# Altium project StLink_Project.PrjPcb (part 2 of 2)
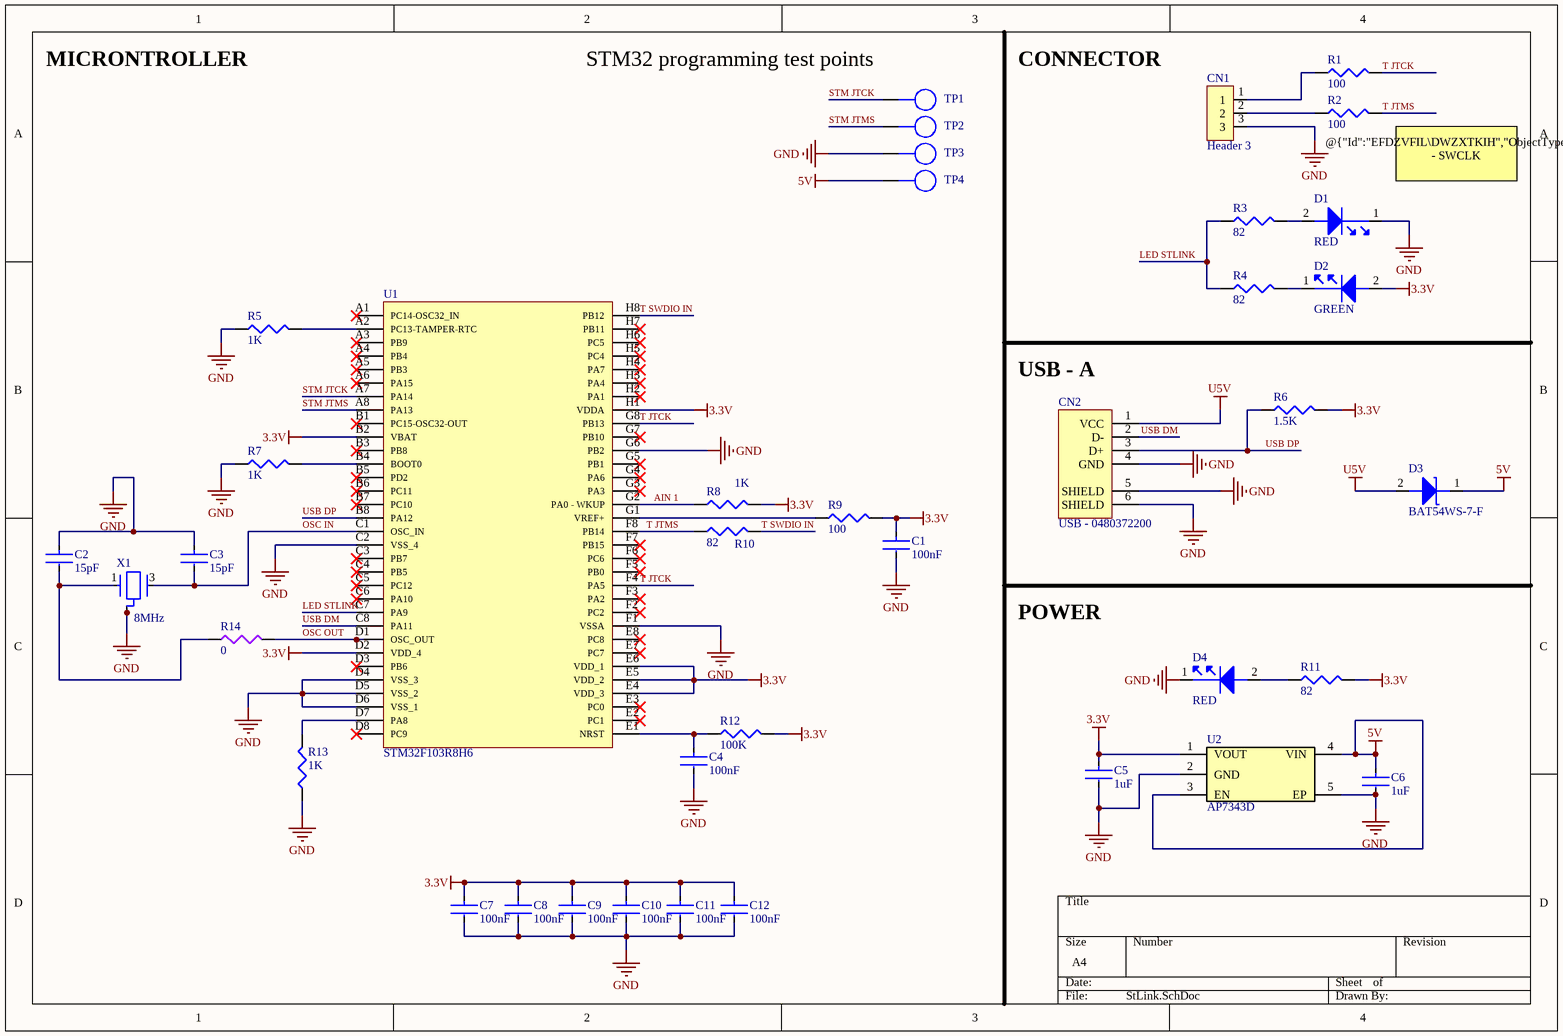
[diagram p1: StLink.SchDoc]

## Sheet StLink.SchDoc (continued)

### Library data of the parts (continued)
R5 R7 R8 R13 = RC0201FR-071KL: Res Thick Film 0201 1K Ohm 1% 0.05W(1/20W) ±200ppm/C Pad SMD T/R; Manufacturer: Yageo Group; Max Power Dissipation: 50mW; Value: 1kΩ; Temperature Coefficient: 200ppm/°C; Voltage Rating: 25V; Supplier: DigiKey; Supplier Part Number: 311-1KMCT-ND; Manufacturer Part Number: RC0201FR-071KL; RoHS: Compliant; Category: Chip SMD Resistors; Stock: 505262; Pricing: 1=0,1, 10=0,034, 25=0,0252, 50=0,0204, 100=0,0168, 250=0,01316, 500=0,01112, 1000=0,00952, 5000=0,00698 (USD); Case/Package: 0201; Case Code (Imperial): 0201; Case Code (Metric): 0603; China RoHS: Non-Compliant; Composition: Thick Film; Contact Plating: Tin; Country of Origin: Mainland China, Taiwan; Depth: 300µm; Export Control Classification Number (ECCN) Code: EAR99; Features: Moisture Resistant; Height: 230µm; Harmonized Tariff Schedule (HTS) Code: 8533.21.00.30; Introduction Date: 2008-07-18; Lead Free: Lead Free; Length: 600µm; Lifecycle Status: Production; Max Operating Temperature: 125°C; Military Standard: Not; Min Operating Temperature: -55°C; Mounting Technology: Surface Mount; Number of Terminals: 2; Number of Terminations: 2; Packaging: Tape & Reel; Power Rating: 50mW; Radiation Hardening: No; REACH SVHC: Yes; Schedule B: 8533210045, 8533210045|8533210045|8533210045|8533210045|8533210045|8533210045|8533210045|8533210045|8533210045|8533210045|8533210045|8533210045|8533210045|8533210045|8533210045|8533210045|8533210045|8533210045|8533210045|8533210045|8533210045|8533210045|8533210045|85; Termination: SMD/SMT; Tolerance: 1%; Voltage Rating (DC): 25V; Width: 300µm; Working Voltage: 25V; ComponentLink1URL: https://datasheet.octopart.com:443/RC0201FR-071KL-Yageo-datasheet-175887523.pdf?src-supplier=Newark; ComponentLink1Description: https://datasheet.octopart.com:443/RC0201FR-071KL-Yageo-datasheet-175887523.pdf?src-supplier=Newark; ComponentLink2URL: https://datasheet.octopart.com:443/RC0201FR-071KL-Yageo-datasheet-10025917.pdf?src-supplier=Newark; ComponentLink2Description: https://datasheet.octopart.com:443/RC0201FR-071KL-Yageo-datasheet-10025917.pdf?src-supplier=Newark; ComponentLink3URL: https://datasheet.octopart.com:443/RC0201FR-071KL-Yageo-datasheet-12509713.pdf?src-supplier=_legacy+Avnet; ComponentLink3Description: https://datasheet.octopart.com:443/RC0201FR-071KL-Yageo-datasheet-12509713.pdf?src-supplier=_legacy+Avnet; ComponentLink4URL: https://datasheet.octopart.com:443/RC0201FR-071KL-Yageo-datasheet-13314888.pdf?src-supplier=Upverter; ComponentLink4Description: https://datasheet.octopart.com:443/RC0201FR-071KL-Yageo-datasheet-13314888.pdf?src-supplier=Upverter; ComponentLink5URL: https://datasheet.octopart.com:443/RC0201FR-071KL-Yageo-datasheet-12549147.pdf?src-supplier=Upverter; ComponentLink5Description: https://datasheet.octopart.com:443/RC0201FR-071KL-Yageo-datasheet-12549147.pdf?src-supplier=Upverter; ComponentLink6URL: https://datasheet.octopart.com:443/RC0201FR-071KL-Yageo-datasheet-12509741.pdf?src-supplier=Upverter; ComponentLink6Description: https://datasheet.octopart.com:443/RC0201FR-071KL-Yageo-datasheet-12509741.pdf?src-supplier=Upverter; ComponentLink7URL: https://datasheet.octopart.com:443/RC0201FR-071KL-Yageo-datasheet-62067350.pdf?src-supplier=element14+APAC; ComponentLink7Description: https://datasheet.octopart.com:443/RC0201FR-071KL-Yageo-datasheet-62067350.pdf?src-supplier=element14+APAC; ComponentLink8URL: https://datasheet.octopart.com:443/RC0201FR-071KL-Yageo-datasheet-10911895.pdf?src-supplier=element14+APAC; ComponentLink8Description: https://datasheet.octopart.com:443/RC0201FR-071KL-Yageo-datasheet-10911895.pdf?src-supplier=element14+APAC; ComponentLink9URL: https://datasheet.octopart.com:443/RC0201FR-071KL-Yageo-Group-datasheet-176638170.pdf?src-supplier=Future+Electronics; ComponentLink9Description: https://datasheet.octopart.com:443/RC0201FR-071KL-Yageo-Group-datasheet-176638170.pdf?src-supplier=Future+Electronics; ComponentLink10URL: https://datasheet.octopart.com:443/RC0201FR-071KL-Yageo-datasheet-164759695.pdf?src-supplier=Future+Electronics; ComponentLink10Description: https://datasheet.octopart.com:443/RC0201FR-071KL-Yageo-datasheet-164759695.pdf?src-supplier=Future+Electronics; ComponentLink11URL: https://datasheet.octopart.com:443/RC0201FR-071KL-Yageo-datasheet-127823281.pdf?src-supplier=Future+Electronics; ComponentLink11Description: https://datasheet.octopart.com:443/RC0201FR-071KL-Yageo-datasheet-127823281.pdf?src-supplier=Future+Electronics; ComponentLink12URL: https://datasheet.octopart.com:443/RC0201FR-071KL-Yageo-datasheet-137700087.pdf?src-supplier=Future+Electronics; ComponentLink12Description: https://datasheet.octopart.com:443/RC0201FR-071KL-Yageo-datasheet-137700087.pdf?src-supplier=Future+Electronics; ComponentLink13URL: https://datasheet.octopart.com:443/RC0201FR-071KL-Yageo-datasheet-103092701.pdf?src-supplier=Future+Electronics; ComponentLink13Description: https://datasheet.octopart.com:443/RC0201FR-071KL-Yageo-datasheet-103092701.pdf?src-supplier=Future+Electronics; ComponentLink14URL: https://datasheet.octopart.com:443/RC0201FR-071KL-Yageo-datasheet-98239111.pdf?src-supplier=Future+Electronics; ComponentLink14Description: https://datasheet.octopart.com:443/RC0201FR-071KL-Yageo-datasheet-98239111.pdf?src-supplier=Future+Electronics; ComponentLink15URL: https://datasheet.octopart.com:443/RC0201FR-071KL-Yageo-datasheet-44382975.pdf?src-supplier=Future+Electronics; ComponentLink15Description: https://datasheet.octopart.com:443/RC0201FR-071KL-Yageo-datasheet-44382975.pdf?src-supplier=Future+Electronics; ComponentLink16URL: https://datasheet.octopart.com:443/RC0201FR-071KL-Yageo-datasheet-41589693.pdf?src-supplier=Future+Electronics; ComponentLink16Description: https://datasheet.octopart.com:443/RC0201FR-071KL-Yageo-datasheet-41589693.pdf?src-supplier=Future+Electronics; ComponentLink17URL: https://datasheet.octopart.com:443/RC0201FR-071KL-Yageo-datasheet-37140709.pdf?src-supplier=Future+Electronics; ComponentLink17Description: https://datasheet.octopart.com:443/RC0201FR-071KL-Yageo-datasheet-37140709.pdf?src-supplier=Future+Electronics; ComponentLink18URL: https://datasheet.octopart.com:443/RC0201FR-071KL-Yageo-datasheet-12509768.pdf?src-supplier=Future+Electronics; ComponentLink18Description: https://datasheet.octopart.com:443/RC0201FR-071KL-Yageo-datasheet-12509768.pdf?src-supplier=Future+Electronics; ComponentLink19URL: https://datasheet.octopart.com:443/RC0201FR-071KL-Yageo-datasheet-12590898.pdf?src-supplier=Future+Electronics; ComponentLink19Description: https://datasheet.octopart.com:443/RC0201FR-071KL-Yageo-datasheet-12590898.pdf?src-supplier=Future+Electronics; ComponentLink20URL: https://datasheet.octopart.com:443/RC0201FR-071KL-Yageo-datasheet-12535854.pdf?src-supplier=Future+Electronics; ComponentLink20Description: https://datasheet.octopart.com:443/RC0201FR-071KL-Yageo-datasheet-12535854.pdf?src-supplier=Future+Electronics; ComponentLink21URL: https://datasheet.octopart.com:443/RC0201FR-071KL-Yageo-datasheet-148775077.pdf?src-supplier=TME; ComponentLink21Description: https://datasheet.octopart.com:443/RC0201FR-071KL-Yageo-datasheet-148775077.pdf?src-supplier=TME; ComponentLink22URL: https://datasheet.octopart.com:443/RC0201FR-071KL-Yageo-datasheet-79472498.pdf?src-supplier=Megastar; ComponentLink22Description: https://datasheet.octopart.com:443/RC0201FR-071KL-Yageo-datasheet-79472498.pdf?src-supplier=Megastar; ComponentLink23URL: https://datasheet.octopart.com/RC0201FR-071KL-Yageo-datasheet-73766026.pdf; ComponentLink23Description: https://datasheet.octopart.com/RC0201FR-071KL-Yageo-datasheet-73766026.pdf; ComponentLink24URL: http://sigma.octopart.com:80/conflict_mineral_statement/Yageo-company-3.pdf?src-supplier=Compliance+Statements; ComponentLink24Description: http://sigma.octopart.com:80/conflict_mineral_statement/Yageo-company-3.pdf?src-supplier=Compliance+Statements; ComponentLink25URL: http://sigma.octopart.com:80/rohs_statement/Yageo-company-2.pdf?src-supplier=Compliance+Statements; ComponentLink25Description: http://sigma.octopart.com:80/rohs_statement/Yageo-company-2.pdf?src-supplier=Compliance+Statements; Supplier 1: DigiKey; Supplier Part Number 1: 311-1KMCT-ND
R6 = RC0201JR-071K5L: Res Thick Film 0201 1.5K Ohm 5% 0.05W(1/20W) ±200ppm/C Pad SMD T/R; Manufacturer: Yageo Group; Max Power Dissipation: 50mW; Value: 1.5kΩ; Temperature Coefficient: 200ppm/°C; Voltage Rating: 25V; Supplier: DigiKey; Supplier Part Number: 311-1.5KNCT-ND; Manufacturer Part Number: RC0201JR-071K5L; RoHS: Compliant; Category: Chip SMD Resistors; Stock: 229427; Pricing: 1=0,1, 10=0,028, 25=0,0204, 50=0,0166, 100=0,0135, 250=0,01048, 500=0,00878, 1000=0,00744, 5000=0,00534 (USD); Case/Package: 0201; Case Code (Imperial): 0201; Case Code (Metric): 0603; China RoHS: Non-Compliant; Composition: Thick Film; Contact Plating: Tin; Country of Origin: Mainland China, Taiwan; Depth: 300µm; Export Control Classification Number (ECCN) Code: EAR99; Features: Moisture Resistant; Height: 230µm; Harmonized Tariff Schedule (HTS) Code: 8533.21.00.30; Introduction Date: 2008-07-18; Lead Free: Lead Free; Length: 600µm; Lifecycle Status: Production; Max Operating Temperature: 125°C; Military Standard: Not; Min Operating Temperature: -55°C; Mounting Technology: Surface Mount; Pins: 2; Number of Terminals: 2; Number of Terminations: 2; Packaging: Tape & Reel; Power Rating: 50mW; Radiation Hardening: No; REACH SVHC: Yes; Schedule B: 8533210045, 8533210045|8533210045|8533210045|8533210045|8533210045; Termination: SMD/SMT; Tolerance: 5%; Voltage Rating (DC): 25V; Width: 300µm; Working Voltage: 25V; ComponentLink1URL: https://datasheet.octopart.com:443/RC0201JR-071K5L-Yageo-datasheet-175887523.pdf?src-supplier=IHS; ComponentLink1Description: https://datasheet.octopart.com:443/RC0201JR-071K5L-Yageo-datasheet-175887523.pdf?src-supplier=IHS; ComponentLink2URL: https://datasheet.octopart.com:443/RC0201JR-071K5L-Yageo-Group-datasheet-176638170.pdf?src-supplier=Future+Electronics; ComponentLink2Description: https://datasheet.octopart.com:443/RC0201JR-071K5L-Yageo-Group-datasheet-176638170.pdf?src-supplier=Future+Electronics; ComponentLink3URL: https://datasheet.octopart.com:443/RC0201JR-071K5L-Yageo-datasheet-164759695.pdf?src-supplier=Future+Electronics; ComponentLink3Description: https://datasheet.octopart.com:443/RC0201JR-071K5L-Yageo-datasheet-164759695.pdf?src-supplier=Future+Electronics; ComponentLink4URL: https://datasheet.octopart.com:443/RC0201JR-071K5L-Yageo-datasheet-127823281.pdf?src-supplier=Future+Electronics; ComponentLink4Description: https://datasheet.octopart.com:443/RC0201JR-071K5L-Yageo-datasheet-127823281.pdf?src-supplier=Future+Electronics; ComponentLink5URL: https://datasheet.octopart.com:443/RC0201JR-071K5L-Yageo-datasheet-137700087.pdf?src-supplier=Future+Electronics; ComponentLink5Description: https://datasheet.octopart.com:443/RC0201JR-071K5L-Yageo-datasheet-137700087.pdf?src-supplier=Future+Electronics; ComponentLink6URL: https://datasheet.octopart.com:443/RC0201JR-071K5L-Yageo-datasheet-103092701.pdf?src-supplier=Future+Electronics; ComponentLink6Description: https://datasheet.octopart.com:443/RC0201JR-071K5L-Yageo-datasheet-103092701.pdf?src-supplier=Future+Electronics; ComponentLink7URL: https://datasheet.octopart.com:443/RC0201JR-071K5L-Yageo-datasheet-98239111.pdf?src-supplier=Future+Electronics; ComponentLink7Description: https://datasheet.octopart.com:443/RC0201JR-071K5L-Yageo-datasheet-98239111.pdf?src-supplier=Future+Electronics; ComponentLink8URL: https://datasheet.octopart.com:443/RC0201JR-071K5L-Yageo-datasheet-79472498.pdf?src-supplier=Future+Electronics; ComponentLink8Description: https://datasheet.octopart.com:443/RC0201JR-071K5L-Yageo-datasheet-79472498.pdf?src-supplier=Future+Electronics; ComponentLink9URL: https://datasheet.octopart.com:443/RC0201JR-071K5L-Yageo-datasheet-12535854.pdf?src-supplier=Future+Electronics; ComponentLink9Description: https://datasheet.octopart.com:443/RC0201JR-071K5L-Yageo-datasheet-12535854.pdf?src-supplier=Future+Electronics; ComponentLink10URL: https://datasheet.octopart.com/RC0201JR-071K5L-Yageo-datasheet-73766026.pdf; ComponentLink10Description: https://datasheet.octopart.com/RC0201JR-071K5L-Yageo-datasheet-73766026.pdf; ComponentLink11URL: https://datasheet.octopart.com:443/RC0201JR-071K5L-Yageo-datasheet-10911895.pdf?src-supplier=Farnell; ComponentLink11Description: https://datasheet.octopart.com:443/RC0201JR-071K5L-Yageo-datasheet-10911895.pdf?src-supplier=Farnell; ComponentLink12URL: https://datasheet.octopart.com:443/RC0201JR-071K5L-Yageo-datasheet-8325180.pdf?src-supplier=Farnell; ComponentLink12Description: https://datasheet.octopart.com:443/RC0201JR-071K5L-Yageo-datasheet-8325180.pdf?src-supplier=Farnell; ComponentLink13URL: http://sigma.octopart.com:80/conflict_mineral_statement/Yageo-company-3.pdf?src-supplier=Compliance+Statements; ComponentLink13Description: http://sigma.octopart.com:80/conflict_mineral_statement/Yageo-company-3.pdf?src-supplier=Compliance+Statements; ComponentLink14URL: http://sigma.octopart.com:80/rohs_statement/Yageo-company-2.pdf?src-supplier=Compliance+Statements; ComponentLink14Description: http://sigma.octopart.com:80/rohs_statement/Yageo-company-2.pdf?src-supplier=Compliance+Statements; Supplier 1: DigiKey; Supplier Part Number 1: 311-1.5KNCT-ND
R12 = RC0201FR-07100KL: 50mW Thick Film Resistors 25V ±1% ±200ppm/℃ 100kΩ 0201 Chip Resistor - Surface Mount ROHS; Manufacturer: Yageo Group; Temperature Coefficient: 200ppm/°C; Supplier: DigiKey; Supplier Part Number: 311-100KMDKR-ND; Manufacturer Part Number: RC0201FR-07100KL; RoHS: Compliant; Category: Chip SMD Resistors; Stock: 1290882; Pricing: 1=0,1, 10=0,034, 25=0,0252, 50=0,0204, 100=0,0168, 250=0,01316, 500=0,01112, 1000=0,00952, 5000=0,00698 (USD); Case/Package: 0201; Case Code (Imperial): 0201; Case Code (Metric): 0603; China RoHS: Non-Compliant; Composition: Thick Film; Contact Plating: Tin; Depth: 300µm; Features: Moisture Resistant; Height: 230µm; Lead Free: Lead Free; Length: 600µm; Lifecycle Status: Production; Max Operating Temperature: 125°C; Max Power Dissipation: 50mW; Military Standard: Not; Min Operating Temperature: -55°C; Mounting Technology: Surface Mount; Pins: 2; Number of Terminals: 2; Number of Terminations: 2; Packaging: Tape & Reel; Power Rating: 50mW; REACH SVHC: Yes; Value: 100kΩ; Schedule B: 8533210045, 8533210045|8533210045|8533210045|8533210045|8533210045|8533210045|8533210045|8533210045|8533210045|8533210045|8533210045|8533210045|8533210045|8533210045, 8533210045|8533210045|8533210045|8533210045|8533210045|8533210045|8533210045|8533210045|8533210045|8533210045|8533210045|8533210045|8533210045|8533210045|8533210045, 8533210045|8533210045|8533210045|8533210045|8533210045|8533210045|8533210045|8533210045|8533210045|8533210045|8533210045|8533210045|8533210045|8533210045|8533210045|8533210045; Termination: SMD/SMT; Tolerance: 1%; Voltage Rating: 25V; Voltage Rating (DC): 25V; Width: 300µm; Working Voltage: 25V; ComponentLink1URL: https://datasheet.octopart.com:443/RC0201FR-07100KL-Yageo-datasheet-175887523.pdf?src-supplier=IHS; ComponentLink1Description: https://datasheet.octopart.com:443/RC0201FR-07100KL-Yageo-datasheet-175887523.pdf?src-supplier=IHS; ComponentLink2URL: https://datasheet.octopart.com:443/RC0201FR-07100KL-Yageo-datasheet-12509713.pdf?src-supplier=element14+APAC; ComponentLink2Description: https://datasheet.octopart.com:443/RC0201FR-07100KL-Yageo-datasheet-12509713.pdf?src-supplier=element14+APAC; ComponentLink3URL: https://datasheet.octopart.com:443/RC0201FR-07100KL-Yageo-datasheet-62067350.pdf?src-supplier=element14+APAC; ComponentLink3Description: https://datasheet.octopart.com:443/RC0201FR-07100KL-Yageo-datasheet-62067350.pdf?src-supplier=element14+APAC; ComponentLink4URL: https://datasheet.octopart.com:443/RC0201FR-07100KL-Yageo-datasheet-10911895.pdf?src-supplier=element14+APAC; ComponentLink4Description: https://datasheet.octopart.com:443/RC0201FR-07100KL-Yageo-datasheet-10911895.pdf?src-supplier=element14+APAC; ComponentLink5URL: https://datasheet.octopart.com:443/RC0201FR-07100KL-Yageo-datasheet-13314888.pdf?src-supplier=Upverter; ComponentLink5Description: https://datasheet.octopart.com:443/RC0201FR-07100KL-Yageo-datasheet-13314888.pdf?src-supplier=Upverter; ComponentLink6URL: https://datasheet.octopart.com:443/RC0201FR-07100KL-Yageo-datasheet-12549147.pdf?src-supplier=Upverter; ComponentLink6Description: https://datasheet.octopart.com:443/RC0201FR-07100KL-Yageo-datasheet-12549147.pdf?src-supplier=Upverter; ComponentLink7URL: https://datasheet.octopart.com:443/RC0201FR-07100KL-Yageo-datasheet-12509741.pdf?src-supplier=Upverter; ComponentLink7Description: https://datasheet.octopart.com:443/RC0201FR-07100KL-Yageo-datasheet-12509741.pdf?src-supplier=Upverter; ComponentLink8URL: https://datasheet.octopart.com:443/RC0201FR-07100KL-Yageo-Group-datasheet-190305687.pdf?src-supplier=Newark; ComponentLink8Description: https://datasheet.octopart.com:443/RC0201FR-07100KL-Yageo-Group-datasheet-190305687.pdf?src-supplier=Newark; ComponentLink9URL: https://datasheet.octopart.com:443/RC0201FR-07100KL-Yageo-datasheet-10025917.pdf?src-supplier=Newark; ComponentLink9Description: https://datasheet.octopart.com:443/RC0201FR-07100KL-Yageo-datasheet-10025917.pdf?src-supplier=Newark; ComponentLink10URL: https://datasheet.octopart.com:443/RC0201FR-07100KL-Yageo-Group-datasheet-176638170.pdf?src-supplier=Future+Electronics; ComponentLink10Description: https://datasheet.octopart.com:443/RC0201FR-07100KL-Yageo-Group-datasheet-176638170.pdf?src-supplier=Future+Electronics; ComponentLink11URL: https://datasheet.octopart.com:443/RC0201FR-07100KL-Yageo-datasheet-164759695.pdf?src-supplier=Future+Electronics; ComponentLink11Description: https://datasheet.octopart.com:443/RC0201FR-07100KL-Yageo-datasheet-164759695.pdf?src-supplier=Future+Electronics; ComponentLink12URL: https://datasheet.octopart.com:443/RC0201FR-07100KL-Yageo-datasheet-127823281.pdf?src-supplier=Future+Electronics; ComponentLink12Description: https://datasheet.octopart.com:443/RC0201FR-07100KL-Yageo-datasheet-127823281.pdf?src-supplier=Future+Electronics; ComponentLink13URL: https://datasheet.octopart.com:443/RC0201FR-07100KL-Yageo-datasheet-137700087.pdf?src-supplier=Future+Electronics; ComponentLink13Description: https://datasheet.octopart.com:443/RC0201FR-07100KL-Yageo-datasheet-137700087.pdf?src-supplier=Future+Electronics; ComponentLink14URL: https://datasheet.octopart.com:443/RC0201FR-07100KL-Yageo-datasheet-103092701.pdf?src-supplier=Future+Electronics; ComponentLink14Description: https://datasheet.octopart.com:443/RC0201FR-07100KL-Yageo-datasheet-103092701.pdf?src-supplier=Future+Electronics; ComponentLink15URL: https://datasheet.octopart.com:443/RC0201FR-07100KL-Yageo-datasheet-98239111.pdf?src-supplier=Future+Electronics; ComponentLink15Description: https://datasheet.octopart.com:443/RC0201FR-07100KL-Yageo-datasheet-98239111.pdf?src-supplier=Future+Electronics; ComponentLink16URL: https://datasheet.octopart.com:443/RC0201FR-07100KL-Yageo-datasheet-44382975.pdf?src-supplier=Future+Electronics; ComponentLink16Description: https://datasheet.octopart.com:443/RC0201FR-07100KL-Yageo-datasheet-44382975.pdf?src-supplier=Future+Electronics; ComponentLink17URL: https://datasheet.octopart.com:443/RC0201FR-07100KL-Yageo-datasheet-41589693.pdf?src-supplier=Future+Electronics; ComponentLink17Description: https://datasheet.octopart.com:443/RC0201FR-07100KL-Yageo-datasheet-41589693.pdf?src-supplier=Future+Electronics; ComponentLink18URL: https://datasheet.octopart.com:443/RC0201FR-07100KL-Yageo-datasheet-37140709.pdf?src-supplier=Future+Electronics; ComponentLink18Description: https://datasheet.octopart.com:443/RC0201FR-07100KL-Yageo-datasheet-37140709.pdf?src-supplier=Future+Electronics; ComponentLink19URL: https://datasheet.octopart.com:443/RC0201FR-07100KL-Yageo-datasheet-12590898.pdf?src-supplier=Future+Electronics; ComponentLink19Description: https://datasheet.octopart.com:443/RC0201FR-07100KL-Yageo-datasheet-12590898.pdf?src-supplier=Future+Electronics; ComponentLink20URL: https://datasheet.octopart.com:443/RC0201FR-07100KL-Yageo-datasheet-5319114.pdf?src-supplier=Future+Electronics; ComponentLink20Description: https://datasheet.octopart.com:443/RC0201FR-07100KL-Yageo-datasheet-5319114.pdf?src-supplier=Future+Electronics; ComponentLink21URL: https://datasheet.octopart.com:443/RC0201FR-07100KL-Yageo-datasheet-12535854.pdf?src-supplier=Future+Electronics; ComponentLink21Description: https://datasheet.octopart.com:443/RC0201FR-07100KL-Yageo-datasheet-12535854.pdf?src-supplier=Future+Electronics; ComponentLink22URL: https://datasheet.octopart.com:443/RC0201FR-07100KL-Yageo-datasheet-148775077.pdf?src-supplier=TME; ComponentLink22Description: https://datasheet.octopart.com:443/RC0201FR-07100KL-Yageo-datasheet-148775077.pdf?src-supplier=TME; ComponentLink23URL: https://datasheet.octopart.com/RC0201FR-07100KL-Yageo-datasheet-73766026.pdf; ComponentLink23Description: https://datasheet.octopart.com/RC0201FR-07100KL-Yageo-datasheet-73766026.pdf; ComponentLink24URL: https://datasheet.octopart.com:443/RC0201FR-07100KL-Yageo-datasheet-8701561.pdf?src-supplier=element14; ComponentLink24Description: https://datasheet.octopart.com:443/RC0201FR-07100KL-Yageo-datasheet-8701561.pdf?src-supplier=element14; ComponentLink25URL: http://sigma.octopart.com:80/conflict_mineral_statement/Yageo-company-3.pdf?src-supplier=Compliance+Statements; ComponentLink25Description: http://sigma.octopart.com:80/conflict_mineral_statement/Yageo-company-3.pdf?src-supplier=Compliance+Statements; ComponentLink26URL: http://sigma.octopart.com:80/rohs_statement/Yageo-company-2.pdf?src-supplier=Compliance+Statements; ComponentLink26Description: http://sigma.octopart.com:80/rohs_statement/Yageo-company-2.pdf?src-supplier=Compliance+Statements; Supplier 1: DigiKey; Supplier Part Number 1: 311-100KMDKR-ND
R14 = RC0201JR-070RL: GENERAL PURPOSE CHIP RESISTOR Metal Glaze/thick Film, 0.05W, 0ohm, Surface Mount, 0201; Manufacturer: Yageo Group; Max Power Dissipation: 50mW; Value: 0Ω; Temperature Coefficient: 200ppm/°C; Tolerance: 5%; Voltage Rating: 25V; Supplier: DigiKey; Supplier Part Number: 311-0.0NDKR-ND; Manufacturer Part Number: RC0201JR-070RL; RoHS: Compliant; Category: Chip SMD Resistors; Stock: 2082175; Pricing: 1=0,1, 10=0,019, 25=0,0156, 50=0,0138, 100=0,012, 250=0,01008, 500=0,0089, 1000=0,0079, 5000=0,00609 (USD); Case/Package: 0201; Case Code (Imperial): 0201; Case Code (Metric): 0603; China RoHS: Non-Compliant; Composition: Thick Film; Contact Plating: Tin; Depth: 300µm; Features: Moisture Resistant; Height: 230µm; Lead Free: Lead Free; Length: 600µm; Lifecycle Status: Production; Max Operating Temperature: 125°C; Military Standard: Not; Min Operating Temperature: -55°C; Mounting Technology: Surface Mount; Pins: 2; Number of Terminals: 2; Number of Terminations: 2; Packaging: Tape & Reel; Power Rating: 50mW; Radiation Hardening: No; REACH SVHC: Yes; Termination: SMD/SMT; Voltage Rating (DC): 25V; Weight: 170.097139µg; Width: 300µm; ComponentLink1URL: https://datasheet.octopart.com:443/RC0201JR-070RL-Yageo-datasheet-182189538.pdf?src-supplier=IHS; ComponentLink1Description: https://datasheet.octopart.com:443/RC0201JR-070RL-Yageo-datasheet-182189538.pdf?src-supplier=IHS; ComponentLink2URL: https://datasheet.octopart.com:443/RC0201JR-070RL-Yageo-datasheet-127823281.pdf?src-supplier=Upverter; ComponentLink2Description: https://datasheet.octopart.com:443/RC0201JR-070RL-Yageo-datasheet-127823281.pdf?src-supplier=Upverter; ComponentLink3URL: https://datasheet.octopart.com:443/RC0201JR-070RL-Yageo-Group-datasheet-190305687.pdf?src-supplier=Newark; ComponentLink3Description: https://datasheet.octopart.com:443/RC0201JR-070RL-Yageo-Group-datasheet-190305687.pdf?src-supplier=Newark; ComponentLink4URL: https://datasheet.octopart.com:443/RC0201JR-070RL-Yageo-datasheet-8325180.pdf?src-supplier=Newark; ComponentLink4Description: https://datasheet.octopart.com:443/RC0201JR-070RL-Yageo-datasheet-8325180.pdf?src-supplier=Newark; ComponentLink5URL: https://datasheet.octopart.com:443/RC0201JR-070RL-Yageo-datasheet-12509713.pdf?src-supplier=element14+APAC; ComponentLink5Description: https://datasheet.octopart.com:443/RC0201JR-070RL-Yageo-datasheet-12509713.pdf?src-supplier=element14+APAC; ComponentLink6URL: https://datasheet.octopart.com:443/RC0201JR-070RL-Yageo-datasheet-62067350.pdf?src-supplier=element14+APAC; ComponentLink6Description: https://datasheet.octopart.com:443/RC0201JR-070RL-Yageo-datasheet-62067350.pdf?src-supplier=element14+APAC; ComponentLink7URL: https://datasheet.octopart.com:443/RC0201JR-070RL-Yageo-datasheet-10911895.pdf?src-supplier=element14+APAC; ComponentLink7Description: https://datasheet.octopart.com:443/RC0201JR-070RL-Yageo-datasheet-10911895.pdf?src-supplier=element14+APAC; ComponentLink8URL: https://datasheet.octopart.com:443/RC0201JR-070RL-Yageo-Group-datasheet-176638170.pdf?src-supplier=Future+Electronics; ComponentLink8Description: https://datasheet.octopart.com:443/RC0201JR-070RL-Yageo-Group-datasheet-176638170.pdf?src-supplier=Future+Electronics; ComponentLink9URL: https://datasheet.octopart.com:443/RC0201JR-070RL-Yageo-datasheet-164759695.pdf?src-supplier=Future+Electronics; ComponentLink9Description: https://datasheet.octopart.com:443/RC0201JR-070RL-Yageo-datasheet-164759695.pdf?src-supplier=Future+Electronics; ComponentLink10URL: https://datasheet.octopart.com:443/RC0201JR-070RL-Yageo-datasheet-137700087.pdf?src-supplier=Future+Electronics; ComponentLink10Description: https://datasheet.octopart.com:443/RC0201JR-070RL-Yageo-datasheet-137700087.pdf?src-supplier=Future+Electronics; ComponentLink11URL: https://datasheet.octopart.com:443/RC0201JR-070RL-Yageo-datasheet-103092701.pdf?src-supplier=Future+Electronics; ComponentLink11Description: https://datasheet.octopart.com:443/RC0201JR-070RL-Yageo-datasheet-103092701.pdf?src-supplier=Future+Electronics; ComponentLink12URL: https://datasheet.octopart.com:443/RC0201JR-070RL-Yageo-datasheet-98239111.pdf?src-supplier=Future+Electronics; ComponentLink12Description: https://datasheet.octopart.com:443/RC0201JR-070RL-Yageo-datasheet-98239111.pdf?src-supplier=Future+Electronics; ComponentLink13URL: https://datasheet.octopart.com:443/RC0201JR-070RL-Yageo-datasheet-44382975.pdf?src-supplier=Future+Electronics; ComponentLink13Description: https://datasheet.octopart.com:443/RC0201JR-070RL-Yageo-datasheet-44382975.pdf?src-supplier=Future+Electronics; ComponentLink14URL: https://datasheet.octopart.com:443/RC0201JR-070RL-Yageo-datasheet-41589693.pdf?src-supplier=Future+Electronics; ComponentLink14Description: https://datasheet.octopart.com:443/RC0201JR-070RL-Yageo-datasheet-41589693.pdf?src-supplier=Future+Electronics; ComponentLink15URL: https://datasheet.octopart.com:443/RC0201JR-070RL-Yageo-datasheet-37140709.pdf?src-supplier=Future+Electronics; ComponentLink15Description: https://datasheet.octopart.com:443/RC0201JR-070RL-Yageo-datasheet-37140709.pdf?src-supplier=Future+Electronics; ComponentLink16URL: https://datasheet.octopart.com:443/RC0201JR-070RL-Yageo-datasheet-12590898.pdf?src-supplier=Future+Electronics; ComponentLink16Description: https://datasheet.octopart.com:443/RC0201JR-070RL-Yageo-datasheet-12590898.pdf?src-supplier=Future+Electronics; ComponentLink17URL: https://datasheet.octopart.com:443/RC0201JR-070RL-Yageo-datasheet-5319114.pdf?src-supplier=Future+Electronics; ComponentLink17Description: https://datasheet.octopart.com:443/RC0201JR-070RL-Yageo-datasheet-5319114.pdf?src-supplier=Future+Electronics; ComponentLink18URL: https://datasheet.octopart.com:443/RC0201JR-070RL-Yageo-datasheet-12535854.pdf?src-supplier=Future+Electronics; ComponentLink18Description: https://datasheet.octopart.com:443/RC0201JR-070RL-Yageo-datasheet-12535854.pdf?src-supplier=Future+Electronics; ComponentLink19URL: https://datasheet.octopart.com:443/RC0201JR-070RL-Yageo-datasheet-148775077.pdf?src-supplier=TME; ComponentLink19Description: https://datasheet.octopart.com:443/RC0201JR-070RL-Yageo-datasheet-148775077.pdf?src-supplier=TME; ComponentLink20URL: https://datasheet.octopart.com/RC0201JR-070RL-Yageo-datasheet-73766026.pdf; ComponentLink20Description: https://datasheet.octopart.com/RC0201JR-070RL-Yageo-datasheet-73766026.pdf; ComponentLink21URL: https://datasheet.octopart.com:443/RC0201JR-070RL-Yageo-datasheet-8701561.pdf?src-supplier=element14; ComponentLink21Description: https://datasheet.octopart.com:443/RC0201JR-070RL-Yageo-datasheet-8701561.pdf?src-supplier=element14; ComponentLink22URL: http://sigma.octopart.com:80/conflict_mineral_statement/Yageo-company-3.pdf?src-supplier=Compliance+Statements; ComponentLink22Description: http://sigma.octopart.com:80/conflict_mineral_statement/Yageo-company-3.pdf?src-supplier=Compliance+Statements; ComponentLink23URL: http://sigma.octopart.com:80/rohs_statement/Yageo-company-2.pdf?src-supplier=Compliance+Statements; ComponentLink23Description: http://sigma.octopart.com:80/rohs_statement/Yageo-company-2.pdf?src-supplier=Compliance+Statements; Supplier 1: DigiKey; Supplier Part Number 1: 311-0.0NDKR-ND
U1 = STM32F103R8H6: MCU 32-bit STM32F ARM Cortex M3 RISC 64KB Flash 2.5V/3.3V 64-Pin TFBGA Tray; Manufacturer: STMicroelectronics; ADC Channels (Resolution): 16-Ch 12-Bit; Data Bus Width: 32b; EEPROM Memory Size: 0B; Frequency: 72MHz; Interface: CAN, USB; Clock Frequency: 16MHz; Max Power Dissipation: 308mW; Max Supply Current: 50mA; Max Supply Voltage: 3.6V; Min Supply Voltage: 2V; Nominal Supply Current: 1.7µA; Number of A/D Converters: 2; Number of ADC Channels: 16; Number of I/Os: 51; Number of Timers/Counters: 4; Number of USART Channels: 3; Operating Supply Voltage: 3.3V; Oscillator Type: Internal; Peripherals: POR; RAM Size: 20kB; Watchdog Timer: Yes; Supplier: DigiKey; Supplier Part Number: 497-11523-ND; Manufacturer Part Number: STM32F103R8H6; RoHS: Compliant; Category: Microcontrollers; Pricing: 3840=4,08947 (USD); Case/Package: FBGA; China RoHS: Compliant; Core Architecture: ARM; Country of Origin: Malaysia; Export Control Classification Number (ECCN) Code: 3A991.A.2; Flash Memory Size: 64kB; Height: 785µm; Harmonized Tariff Schedule (HTS) Code: 8542.31.00.30; Introduction Date: 2007-06-07; Lead Free: Lead Free; Length: 5mm; Lifecycle Status: Production; Max Operating Temperature: 85°C; Memory Size: 64kB; Memory Format: FLASH; Min Operating Temperature: -40°C; Number of I2C Channels: 2; Pins: 64; Number of Programmable I/O: 51; Number of SPI Channels: 2; Number of Terminals: 64; Radiation Hardening: No; REACH SVHC: Yes; Temperature Grade: Industrial; Terminal Pitch: 500µm; Width: 5mm; ComponentLink1URL: https://datasheet.octopart.com:443/STM32F103R8H6-STMicroelectronics-datasheet-177520228.pdf?src-supplier=IHS; ComponentLink1Description: https://datasheet.octopart.com:443/STM32F103R8H6-STMicroelectronics-datasheet-177520228.pdf?src-supplier=IHS; ComponentLink2URL: https://datasheet.octopart.com:443/STM32F103R8H6-STMicroelectronics-datasheet-14363502.pdf?src-supplier=Upverter; ComponentLink2Description: https://datasheet.octopart.com:443/STM32F103R8H6-STMicroelectronics-datasheet-14363502.pdf?src-supplier=Upverter; ComponentLink3URL: https://datasheet.octopart.com:443/STM32F103R8H6-STMicroelectronics-datasheet-48026265.pdf?src-supplier=Farnell; ComponentLink3Description: https://datasheet.octopart.com:443/STM32F103R8H6-STMicroelectronics-datasheet-48026265.pdf?src-supplier=Farnell; ComponentLink4URL: https://datasheet.octopart.com:443/STM32F103R8H6-STMicroelectronics-datasheet-21407612.pdf?src-supplier=Farnell; ComponentLink4Description: https://datasheet.octopart.com:443/STM32F103R8H6-STMicroelectronics-datasheet-21407612.pdf?src-supplier=Farnell; ComponentLink5URL: https://datasheet.octopart.com:443/STM32F103R8H6-STMicroelectronics-datasheet-16809485.pdf?src-supplier=Farnell; ComponentLink5Description: https://datasheet.octopart.com:443/STM32F103R8H6-STMicroelectronics-datasheet-16809485.pdf?src-supplier=Farnell; ComponentLink6URL: https://datasheet.octopart.com:443/STM32F103R8H6-STMicroelectronics-datasheet-10330614.pdf?src-supplier=Newark; ComponentLink6Description: https://datasheet.octopart.com:443/STM32F103R8H6-STMicroelectronics-datasheet-10330614.pdf?src-supplier=Newark; ComponentLink7URL: https://datasheet.octopart.com:443/STM32F103R8H6-STMicroelectronics-datasheet-500013.pdf?src-supplier=Factory+Futures; ComponentLink7Description: https://datasheet.octopart.com:443/STM32F103R8H6-STMicroelectronics-datasheet-500013.pdf?src-supplier=Factory+Futures; ComponentLink8URL: https://datasheet.octopart.com:443/STM32F103R8H6-STMicroelectronics-datasheet-6396519.pdf?src-supplier=Augswan; ComponentLink8Description: https://datasheet.octopart.com:443/STM32F103R8H6-STMicroelectronics-datasheet-6396519.pdf?src-supplier=Augswan; ComponentLink9URL: https://datasheet.octopart.com:443/STM32F103R8H6-STMicroelectronics-datasheet-14106722.pdf?src-supplier=iiiC; ComponentLink9Description: https://datasheet.octopart.com:443/STM32F103R8H6-STMicroelectronics-datasheet-14106722.pdf?src-supplier=iiiC; ComponentLink10URL: https://datasheet.octopart.com:443/STM32F103R8H6-STMicroelectronics-datasheet-8700640.pdf?src-supplier=Arrow+Electronics; ComponentLink10Description: https://datasheet.octopart.com:443/STM32F103R8H6-STMicroelectronics-datasheet-8700640.pdf?src-supplier=Arrow+Electronics; Supplier 1: DigiKey; Supplier Part Number 1: 497-11523-ND
U2 = AP7343D-33FS4-7B: Ldo, Fixed, 3.3V, 0.3A, -40 To 85Deg C Rohs Compliant: Yes |Diodes Inc. AP7343D-33FS4-7B; Dropout Voltage: 220mV; Max Supply Voltage: 5.25V; Max Junction Temperature (Tj): 125°C; Min Input Voltage: 4.3V; Number of Circuits: 1; Output Current: 300mA; Voltage Tolerance: 1%; Supplier: DigiKey; Supplier Part Number: AP7343D-33FS4-7BDICT-ND; Manufacturer: Diodes Inc.; Manufacturer Part Number: AP7343D-33FS4-7B; RoHS: Compliant; Category: LDO Voltage Regulators; Stock: 9621; Pricing: 1=0,11, 10=0,076, 25=0,0664, 100=0,0557, 250=0,05072, 500=0,04772, 1000=0,04524, 2500=0,04261, 5000=0,04103, 10000=0,03973, 20000=0,03865, 30000=0,03812, 50000=0,03752, 70000=0,03717, 100000=0,03684, 250000=0,03612 (USD); China RoHS: Compliant; Country of Origin: Mainland China; Export Control Classification Number (ECCN) Code: EAR99; Height - Seated (Max): 400µm; Harmonized Tariff Schedule (HTS) Code: 8542.39.00.60; Introduction Date: 2015-12-08; Length: 1mm; Lifecycle Status: Production; Max Operating Temperature: 85°C; Min Operating Temperature: -40°C; Mounting Technology: Surface Mount; Number of Outputs: 1; Number of Regulators: 1; Number of Terminals: 4; Output Voltage: 3.3V; REACH SVHC: Yes; Terminal Pitch: 650µm; Width: 1mm; ComponentLink1URL: https://datasheet.octopart.com:443/AP7343D-33FS4-7B-Diodes-Inc.-datasheet-160640090.pdf?src-supplier=IHS; ComponentLink1Description: https://datasheet.octopart.com:443/AP7343D-33FS4-7B-Diodes-Inc.-datasheet-160640090.pdf?src-supplier=IHS; ComponentLink2URL: https://datasheet.octopart.com:443/AP7343D-33FS4-7B-Diodes-Inc.-datasheet-76801213.pdf?src-supplier=SHENGYU+ELECTRONICS; ComponentLink2Description: https://datasheet.octopart.com:443/AP7343D-33FS4-7B-Diodes-Inc.-datasheet-76801213.pdf?src-supplier=SHENGYU+ELECTRONICS; Supplier 1: DigiKey; Supplier Part Number 1: AP7343D-33FS4-7BDICT-ND; Supplier Location 1: US; Supplier Unit Price 1: $0.11; Supplier Packaging 1: Cut Tape; LCSC: C260892
X1 = ECS-80-12-33-JGN-TR: Crystal 8MHz ±20ppm (Tol) ±30ppm (Stability) 12pF FUND 400Ohm 4-Pin Mini-CSMD T/R; Manufacturer: ECS International; Frequency Tolerance: 0.002%; ESR: 400Ω; Supplier: DigiKey; Supplier Part Number: 50-ECS-80-12-33-JGN-CT-ND; Manufacturer Part Number: ECS-80-12-33-JGN-TR; RoHS: Compliant; Category: Crystals; Stock: 8185; Pricing: 1=0,58, 10=0,508, 25=0,4808, 50=0,461, 100=0,4419, 250=0,41784, 500=0,40056 (USD); Country of Origin: South Korea, Taiwan; Frequency: 8MHz; Frequency Stability: 30ppm; Harmonized Tariff Schedule (HTS) Code: 8541.60.00.50; Introduction Date: 2018-05-11; Lifecycle Status: Production; Load Capacitance: 12pF; Max Operating Temperature: 85°C; Min Operating Temperature: -40°C; Mounting Technology: Surface Mount; REACH SVHC: Yes; Schedule B: 8541600025, 8541600025|8541600025, 8541600025|8541600025|8541600025, 8541600025|8541600025|8541600025|8541600025; ComponentLink1URL: https://datasheet.octopart.com:443/ECS-80-12-33-JGN-TR-ECS-International-datasheet-182217405.pdf?src-supplier=IHS; ComponentLink1Description: https://datasheet.octopart.com:443/ECS-80-12-33-JGN-TR-ECS-International-datasheet-182217405.pdf?src-supplier=IHS; ComponentLink2URL: https://datasheet.octopart.com:443/ECS-80-12-33-JGN-TR-ECS-International-datasheet-17018741.pdf?src-supplier=Master+Electronics; ComponentLink2Description: https://datasheet.octopart.com:443/ECS-80-12-33-JGN-TR-ECS-International-datasheet-17018741.pdf?src-supplier=Master+Electronics; ComponentLink3URL: https://datasheet.octopart.com:443/ECS-80-12-33-JGN-TR-ECS-International-datasheet-179230830.pdf?src-supplier=Master+Electronics; ComponentLink3Description: https://datasheet.octopart.com:443/ECS-80-12-33-JGN-TR-ECS-International-datasheet-179230830.pdf?src-supplier=Master+Electronics; ComponentLink4URL: https://datasheet.octopart.com:443/ECS-80-12-33-JGN-TR-ECS-International-datasheet-140089731.pdf?src-supplier=Future+Electronics; ComponentLink4Description: https://datasheet.octopart.com:443/ECS-80-12-33-JGN-TR-ECS-International-datasheet-140089731.pdf?src-supplier=Future+Electronics; Supplier 1: DigiKey; Supplier Part Number 1: 50-ECS-80-12-33-JGN-CT-ND